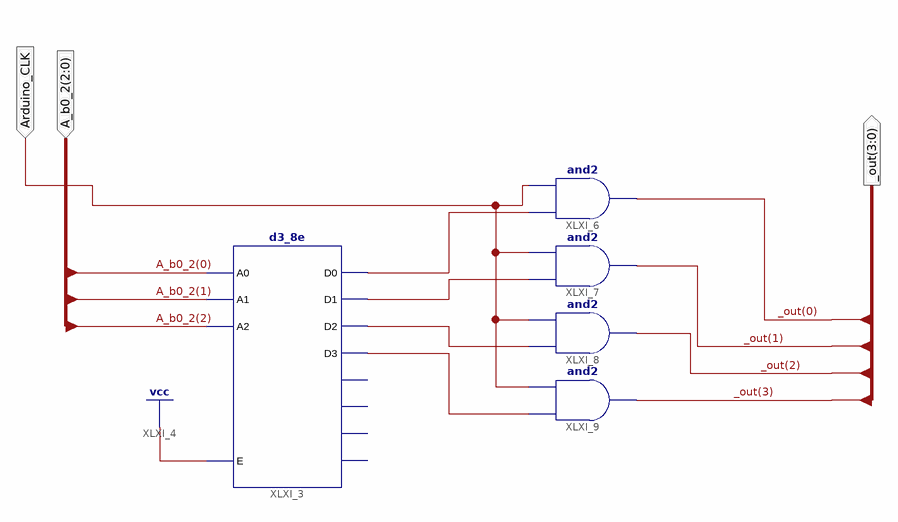
[diagram p0: schematic sheet 1]
// Xilinx ISE schematic ARDUINO_Controller.sch (spartan6) as structural Verilog: 5 symbols, 3 ports
module ARDUINO_Controller (
  input  [2:0] A_b0_2,
  input  Arduino_CLK,
  output [3:0] _out
);

  wire XLXN_33, XLXN_34, XLXN_35, XLXN_41;

  and XLXI_6 (_out[0], XLXN_41, Arduino_CLK);
  and XLXI_7 (_out[1], XLXN_35, Arduino_CLK);
  and XLXI_8 (_out[2], XLXN_34, Arduino_CLK);
  and XLXI_9 (_out[3], XLXN_33, Arduino_CLK);
  d3_8e XLXI_3 (
    .A0(A_b0_2[0]), .A1(A_b0_2[1]), .A2(A_b0_2[2]), .E(1'b1), .D0(XLXN_41), .D1(XLXN_35), .D2(XLXN_34),
    .D3(XLXN_33));  // open: D4, D5, D6, D7
endmodule
